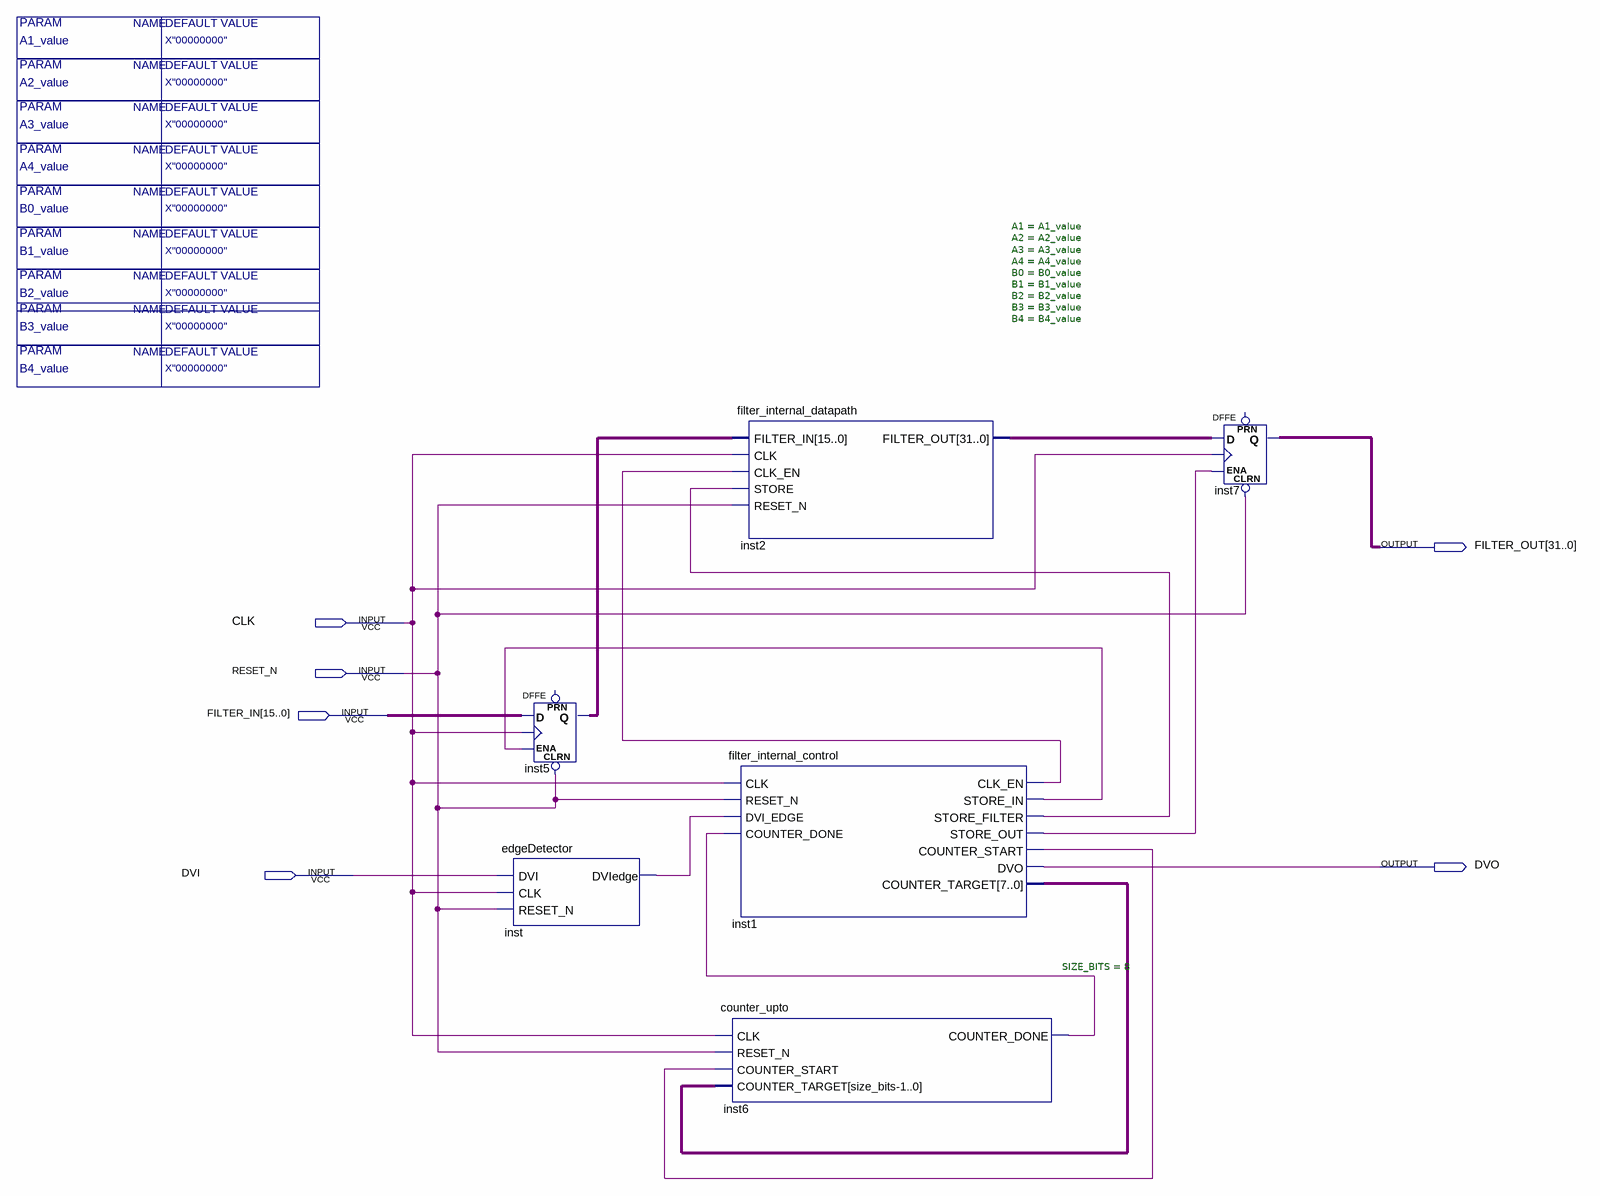
[diagram p0: schematic sheet]
// Quartus schematic Filter_internal.bdf as structural Verilog: 6 symbols, 6 pins
module Filter_internal #(parameter A1_value = "X\"00000000\"", parameter A2_value = "X\"00000000\"", parameter B0_value = "X\"00000000\"", parameter B1_value = "X\"00000000\"", parameter B2_value = "X\"00000000\"", parameter A3_value = "X\"00000000\"", parameter A4_value = "X\"00000000\"", parameter B3_value = "X\"00000000\"", parameter B4_value = "X\"00000000\"") (
  input  CLK,
  input  RESET_N,
  input  [15:0] FILTER_IN,
  input  DVI,
  output [31:0] FILTER_OUT,
  output DVO
);

  wire inst1_clk_en, inst1_counter_start, inst1_store_filter, inst1_store_in, inst1_store_out,
       inst6_counter_done, inst_dviedge;
  wire [7:0] inst1_counter_target;
  wire [15:0] inst5_q;
  wire [31:0] inst2_filter_out;

  DFFE inst5[15:0] (.CLRN(RESET_N), .D(FILTER_IN), .CLK(CLK), .ENA(inst1_store_in), .Q(inst5_q));  // open: PRN
  edgeDetector inst (.DVI(DVI), .CLK(CLK), .RESET_N(RESET_N), .DVIedge(inst_dviedge));
  filter_internal_datapath #(.A1(A1_value), .A2(A2_value), .A3(A3_value), .A4(A4_value), .B0(B0_value), .B1(B1_value), .B2(B2_value), .B3(B3_value), .B4(B4_value)) inst2 (
    .FILTER_IN(inst5_q), .CLK(CLK), .CLK_EN(inst1_clk_en), .STORE(inst1_store_filter), .RESET_N(RESET_N),
    .FILTER_OUT(inst2_filter_out));
  filter_internal_control inst1 (
    .CLK(CLK), .RESET_N(RESET_N), .DVI_EDGE(inst_dviedge), .COUNTER_DONE(inst6_counter_done),
    .CLK_EN(inst1_clk_en), .STORE_IN(inst1_store_in), .STORE_FILTER(inst1_store_filter),
    .STORE_OUT(inst1_store_out), .COUNTER_START(inst1_counter_start), .DVO(DVO),
    .COUNTER_TARGET(inst1_counter_target));
  counter_upto #(.SIZE_BITS(8)) inst6 (
    .CLK(CLK), .RESET_N(RESET_N), .COUNTER_START(inst1_counter_start), .COUNTER_TARGET(inst1_counter_target),
    .COUNTER_DONE(inst6_counter_done));
  DFFE inst7[31:0] (
    .CLRN(RESET_N), .D(inst2_filter_out), .CLK(CLK), .ENA(inst1_store_out), .Q(FILTER_OUT));  // open: PRN
endmodule
